# Altium schematic sheet LED_Indi.SchDoc
size A4
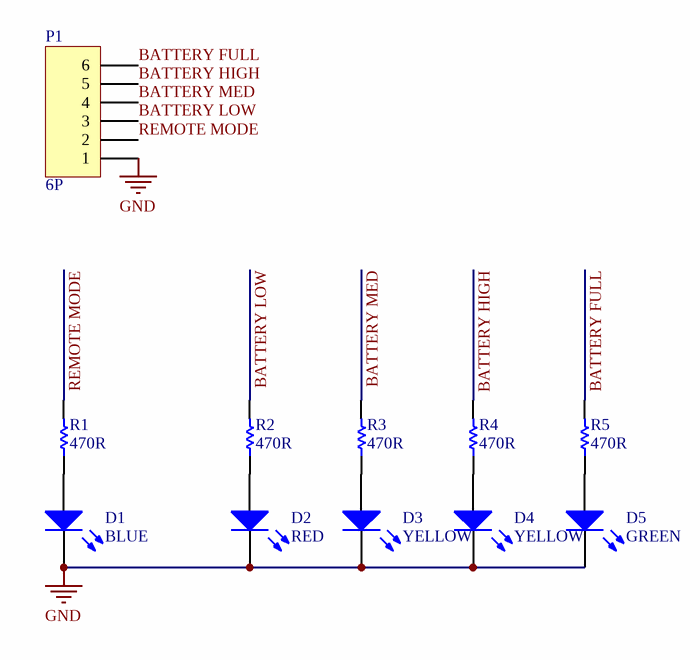
[diagram p0: LED_Indi.SchDoc]

## Parts
D1  value BLUE  [LED0805]
D2  value RED  [LED0805]
D3  value YELLOW  [LED0805]
D4  value YELLOW  [LED0805]
D5  value GREEN  [LED0805]
P1  value 6P  [HDR1X6H]  (hidden comment: Jump đực chân thẳng, 2.54mm 6P)
R1  value 470R  [0805DD]
R2  value 470R  [0805DD]
R3  value 470R  [0805DD]
R4  value 470R  [0805DD]
R5  value 470R  [0805DD]

## Nets
GND: D1.2(K) D2.2(K) D3.2(K) D4.2(K) D5.2(K) P1.1
BATTERY FULL: P1.6 R5.2
BATTERY HIGH: P1.5 R4.2
BATTERY LOW: P1.3 R2.2
BATTERY MED: P1.4 R3.2
REMOTE MODE: P1.2 R1.2
NetD1_1: D1.1(A) R1.1
NetD2_1: D2.1(A) R2.1
NetD3_1: D3.1(A) R3.1
NetD4_1: D4.1(A) R4.1
NetD5_1: D5.1(A) R5.1

## Library data of the parts
D1-D5 = LED0: Typical INFRARED GaAs LED; Type1: LED dán 0805; Type2: LED chân cắm 3mm; Type3: LED chân cắm 5mm; Published: *; LatestRevisionDate: *; LatestRevisionNote: *; PackageReference: *; Publisher: *
P1 = Header 6H: Header, 6-Pin, Right Angle; LatestRevisionDate: 17-Jul-2002; LatestRevisionNote: Re-released for DXP Platform.; Publisher: Altium Limited
R1-R5 = Res Semi: Semiconductor Resistor; Type1: Điện trở dán 0805; Type2: Điện trở chân cắm 1/4W; Type3: Điện trở chân cắm 2W; Type4: Điện trở dán 2512; Published: *; LatestRevisionDate: *; LatestRevisionNote: *; PackageReference: *; Publisher: *